# Altium schematic sheet POWER-SUPPLY.SchDoc
size A; SheetNumber: 4; SheetTotal: 4
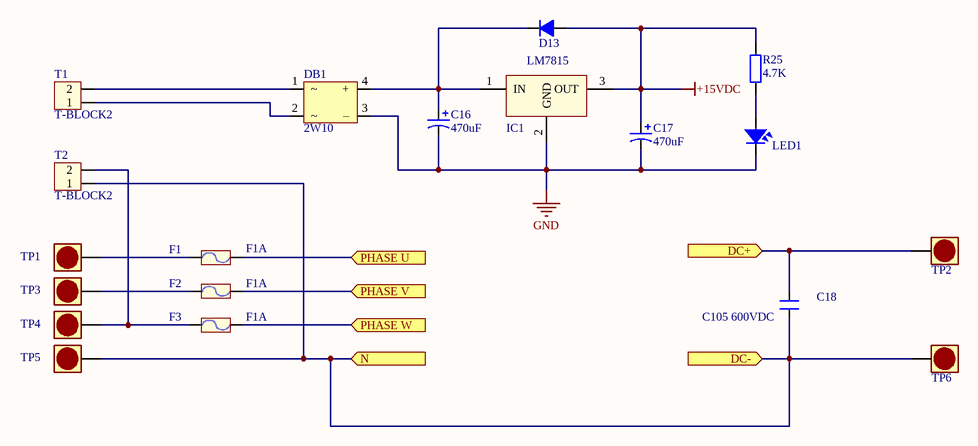
[diagram p0: POWER-SUPPLY.SchDoc]

## Parts
C16  470uF  [C6mm]
C17  470uF  [C6mm]
C18  C105 600VDC  [CAP-POLY-25mm]
D13  Diode  1N4007  [DO41-1A]  (value not drawn)
DB1  2W10  [DB-2W10]
F1  F1A  [Fuse]
F2  F1A  [Fuse]
F3  F1A  [Fuse]
IC1  LM7815  [QTO-220]
LED1  LED  [LED-5-BLUE]  (value not drawn)
R25  4.7K  [R1/4W]
T1  T-BLOCK2  [T-2EDGV-5.08- 2P]
T2  T-BLOCK2  [T-2EDGV-5.08- 2P]
TP1  JP1P  [PW-JP]  (value not drawn)
TP2  JP1P  [PW-JP]  (value not drawn)
TP3  JP1P  [PW-JP]  (value not drawn)
TP4  JP1P  [PW-JP]  (value not drawn)
TP5  JP1P  [PW-JP]  (value not drawn)
TP6  JP1P  [PW-JP]  (value not drawn)

## Ports
DC+ (in), DC- (in), N (in), PHASE U (in), PHASE V (in), PHASE W (in)

## Nets
+15VDC: C17.1 D13.1 IC1.3(OUT) R25.2
GND: C16.2 C17.2 DB1.3(–) IC1.2(GND) LED1.2
DC+: C18.2 TP2.1 ; port DC+
DC-: C18.1 T2.1 TP5.1 TP6.1 ; port N, port DC-
PHASE U: F1.2 ; port PHASE U
PHASE V: F2.2 ; port PHASE V
PHASE W: F3.2 ; port PHASE W
NetC16_1: C16.1 D13.2 DB1.4(+) IC1.1(IN)
NetDB1_1: DB1.1 T1.2
NetDB1_2: DB1.2 T1.1
NetF1_1: F1.1 TP1.1
NetF2_1: F2.1 TP3.1
NetF3_1: F3.1 T2.2 TP4.1
NetLED1_1: LED1.1 R25.1

## Library data of the parts
C16 C17 = CAP-Radial: Published: 8-Jun-2000; LatestRevisionDate: 17-Jul-2002; LatestRevisionNote: Re-released for DXP Platform.; PackageReference: POLAR0.8; Publisher: Altium Limited; value: ?
C18 = CAP-POLY
D13 = Diode  1N4007: Diode 1A; Value: 1N4007
DB1 = DIODE BRIDGE1
F1-F3 = Fuse: Designed by: VanDungEvn; Value: Fuse
IC1 = LM78xx: On ap +, from + 5 to + 24VDC; Value: LM7805
LED1 = LED: LED Single colour Green and Red; Value: LED 3 ly Single Colour
R25 = R1/4W: Resistor 1/4W; Value: R1/4W - 1K
T1 T2 = T-BLOCK2: T-BLOCK2(Green); Value: Header 2